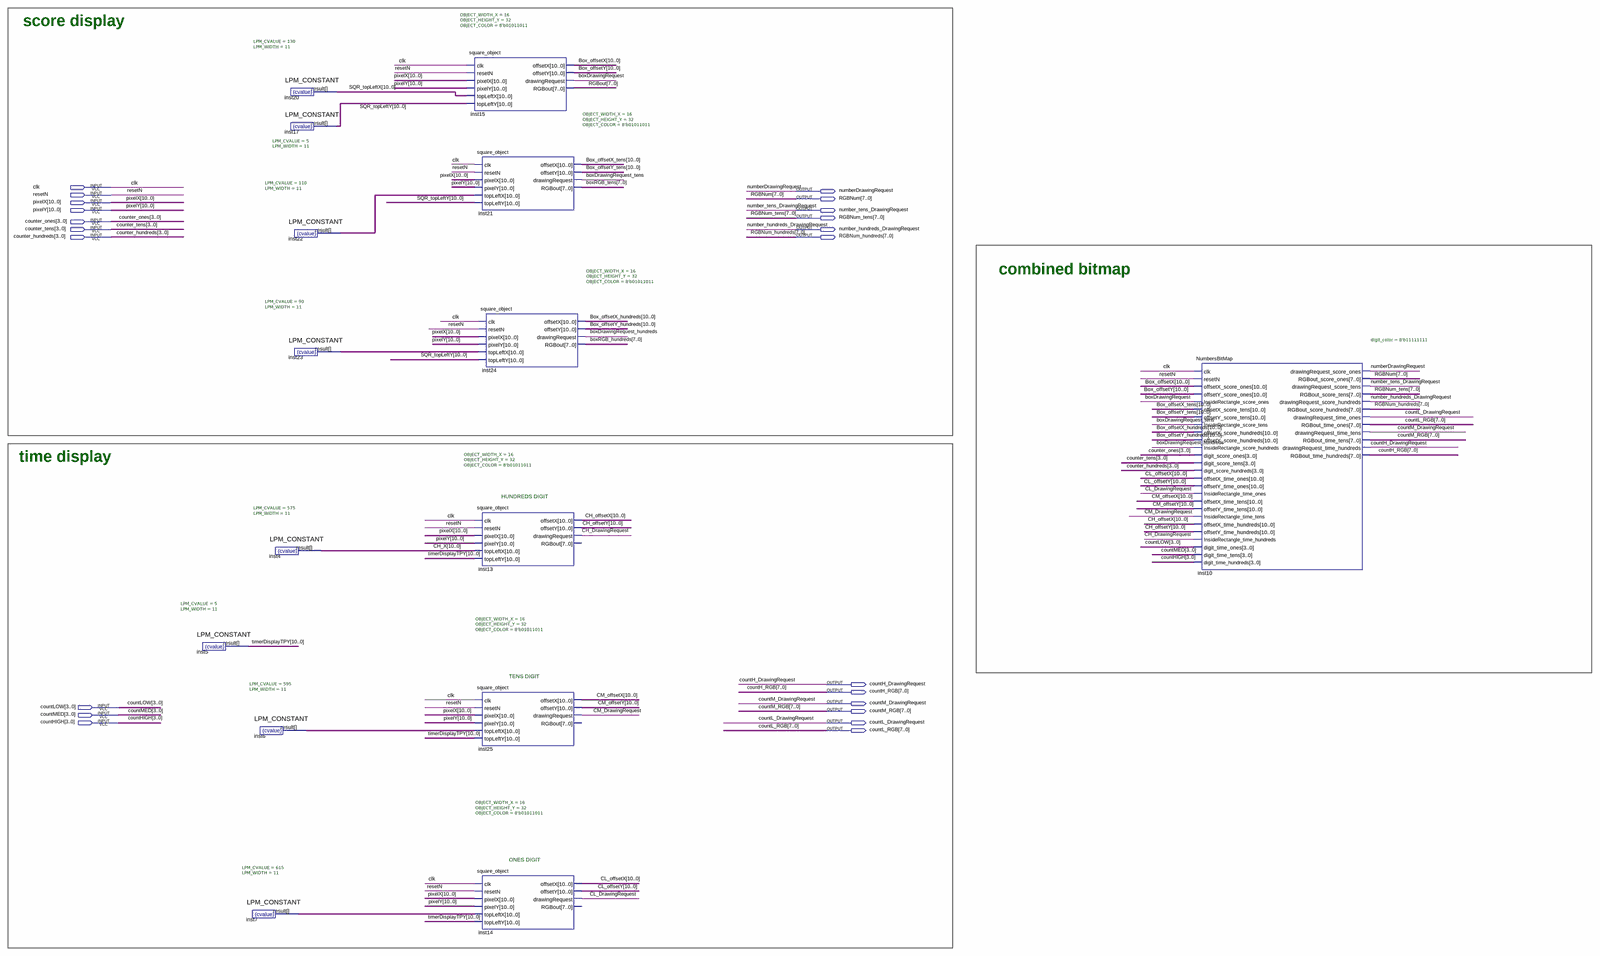
[diagram p0: schematic sheet, whole]
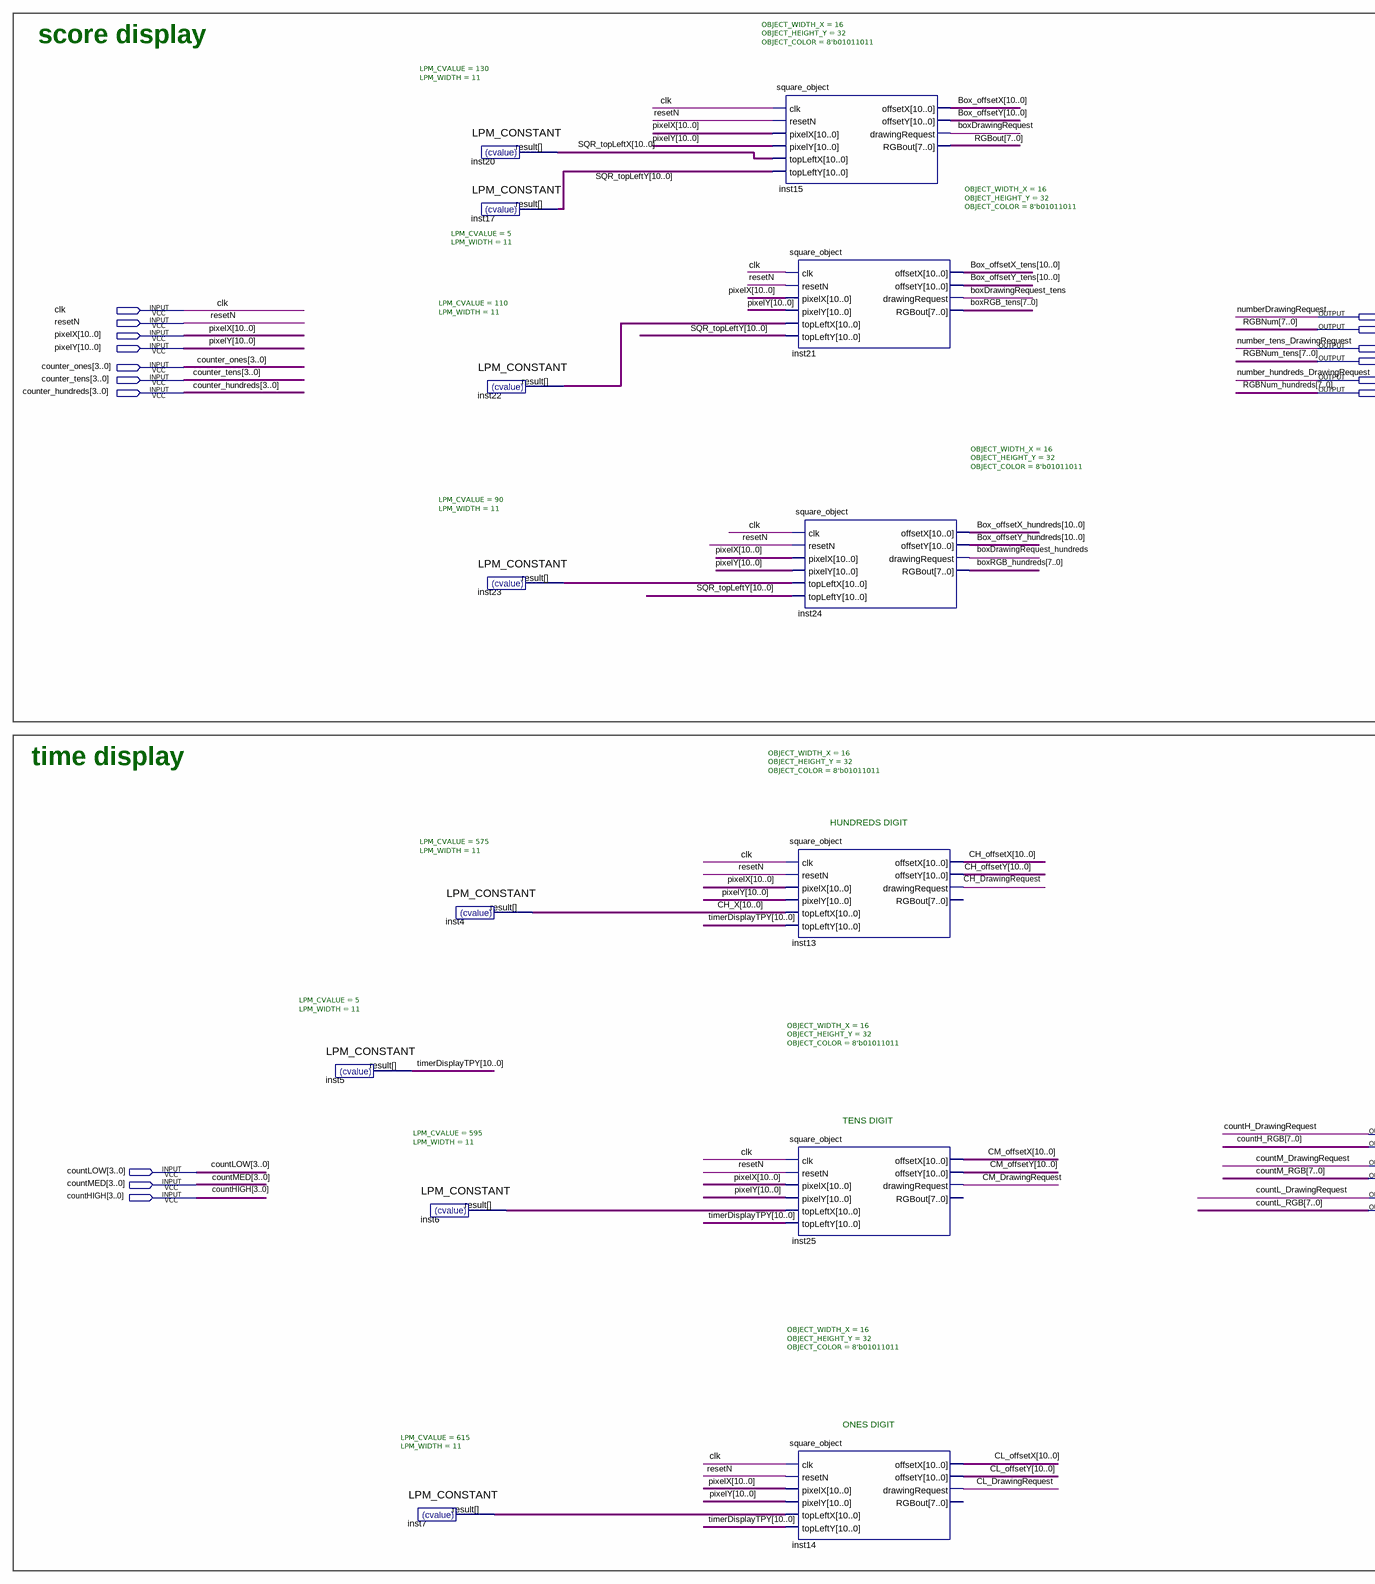
[diagram p1: schematic sheet, left part]
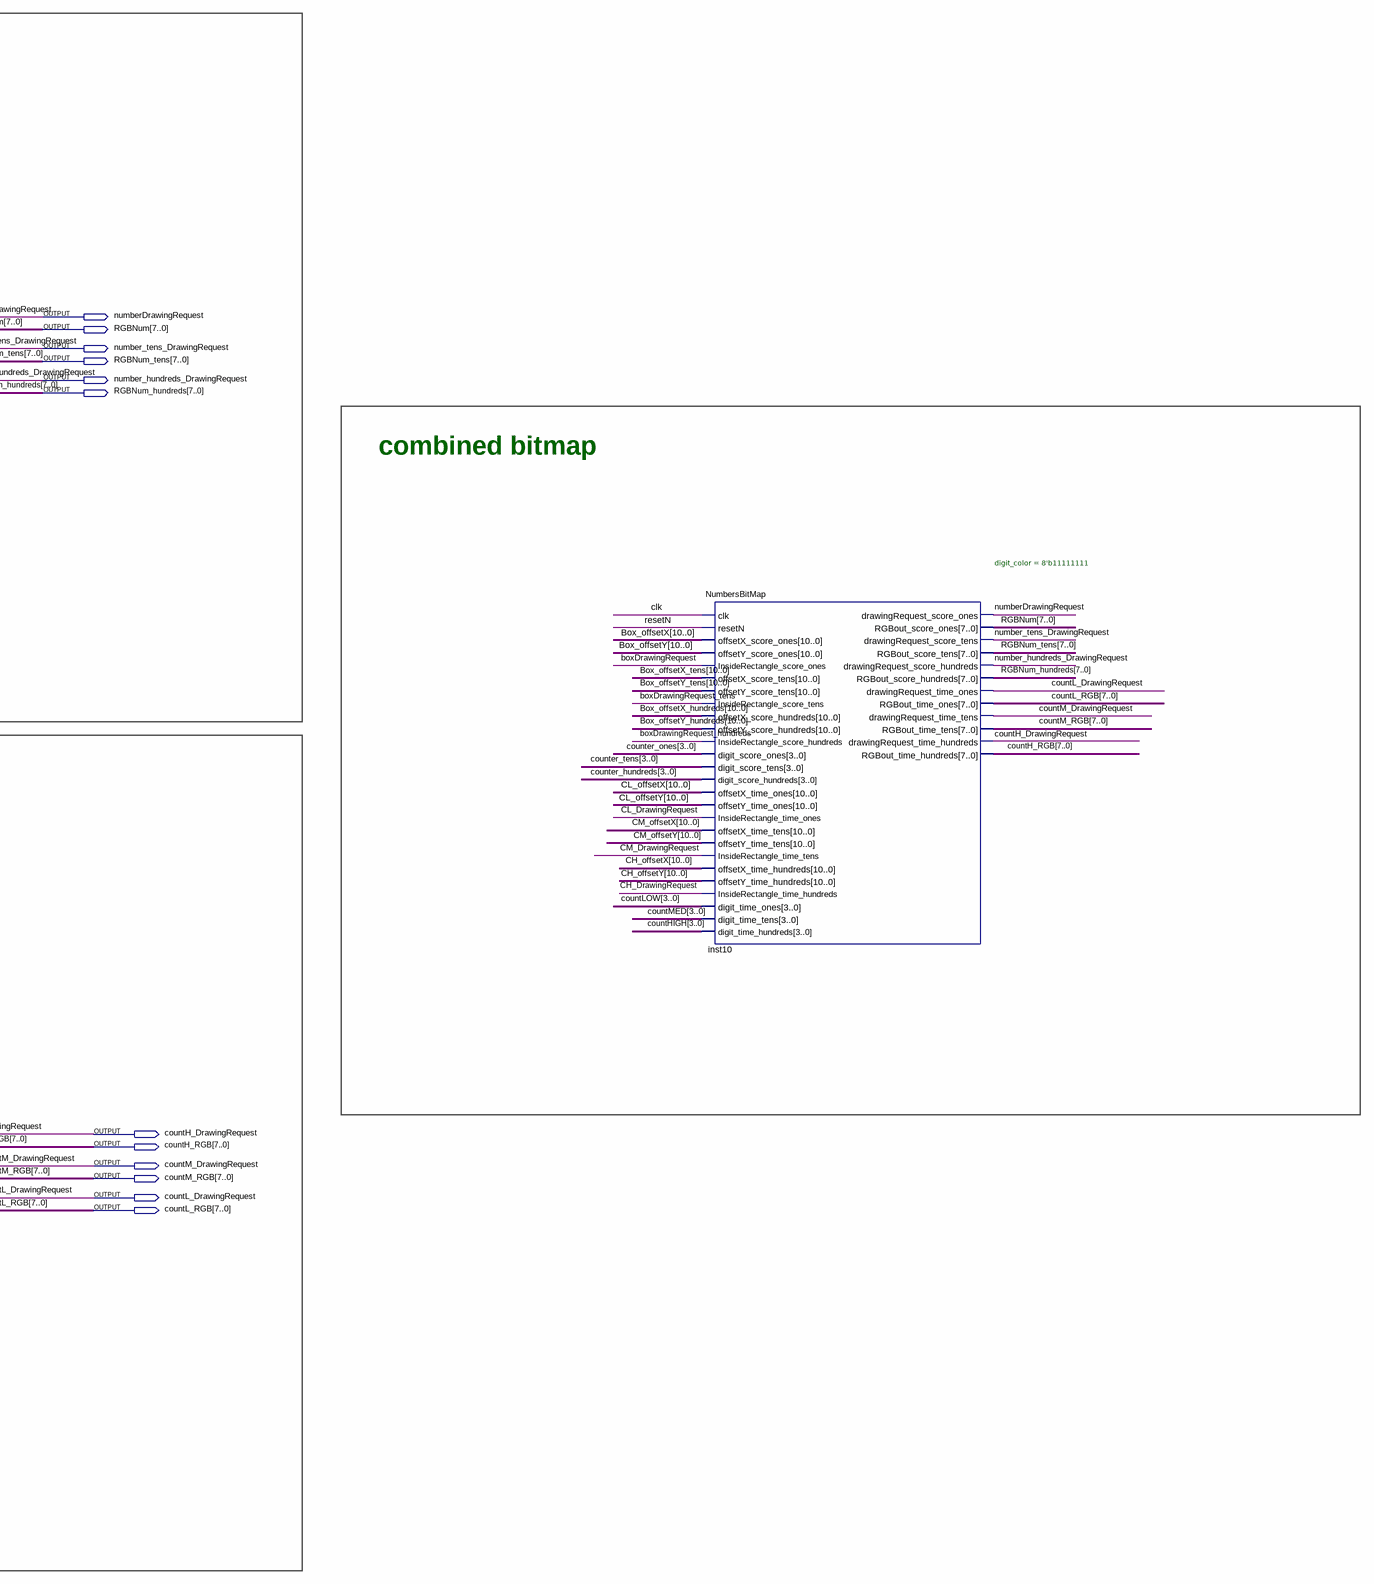
[diagram p2: schematic sheet, right part]
// Quartus schematic Score_and_Time_Display_Block.bdf as structural Verilog: 15 symbols, 22 pins
module Score_and_Time_Display_Block (
  input  clk,
  input  resetN,
  input  [10:0] pixelX,
  input  [10:0] pixelY,
  input  [3:0] counter_ones,
  input  [3:0] counter_tens,
  input  [3:0] counter_hundreds,
  input  [3:0] countLOW,
  input  [3:0] countMED,
  input  [3:0] countHIGH,
  output numberDrawingRequest,
  output [7:0] RGBNum,
  output number_tens_DrawingRequest,
  output [7:0] RGBNum_tens,
  output number_hundreds_DrawingRequest,
  output [7:0] RGBNum_hundreds,
  output countH_DrawingRequest,
  output [7:0] countH_RGB,
  output countM_DrawingRequest,
  output [7:0] countM_RGB,
  output countL_DrawingRequest,
  output [7:0] countL_RGB
);

  wire boxDrawingRequest, boxDrawingRequest_hundreds, boxDrawingRequest_tens, CH_DrawingRequest,
       CL_DrawingRequest, CM_DrawingRequest;
  wire [7:0] boxRGB_hundreds, boxRGB_tens, RGBout;
  wire [10:0] Box_offsetX, Box_offsetX_hundreds, Box_offsetX_tens, Box_offsetY, Box_offsetY_hundreds,
       Box_offsetY_tens, CH_offsetX, CH_offsetY, CH_X, CL_offsetX, CL_offsetY, CM_offsetX, CM_offsetY,
       inst6_result, inst7_result, inst22_result, inst23_result, SQR_topLeftX, SQR_topLeftY, timerDisplayTPY;

  LPM_CONSTANT #(.LPM_CVALUE(5), .LPM_WIDTH(11)) inst5 (.result(timerDisplayTPY));
  LPM_CONSTANT #(.LPM_CVALUE(595), .LPM_WIDTH(11)) inst6 (.result(inst6_result));
  LPM_CONSTANT #(.LPM_CVALUE(615), .LPM_WIDTH(11)) inst7 (.result(inst7_result));
  LPM_CONSTANT #(.LPM_CVALUE(130), .LPM_WIDTH(11)) inst20 (.result(SQR_topLeftX));
  LPM_CONSTANT #(.LPM_CVALUE(5), .LPM_WIDTH(11)) inst17 (.result(SQR_topLeftY));
  LPM_CONSTANT #(.LPM_CVALUE(110), .LPM_WIDTH(11)) inst22 (.result(inst22_result));
  LPM_CONSTANT #(.LPM_CVALUE(90), .LPM_WIDTH(11)) inst23 (.result(inst23_result));
  LPM_CONSTANT #(.LPM_CVALUE(575), .LPM_WIDTH(11)) inst4 (.result(CH_X));
  square_object #(.OBJECT_WIDTH_X(16), .OBJECT_HEIGHT_Y(32), .OBJECT_COLOR(8'b01011011)) inst15 (
    .clk(clk), .resetN(resetN), .pixelX(pixelX), .pixelY(pixelY), .topLeftX(SQR_topLeftX),
    .topLeftY(SQR_topLeftY), .offsetX(Box_offsetX), .offsetY(Box_offsetY),
    .drawingRequest(boxDrawingRequest), .RGBout(RGBout));
  square_object #(.OBJECT_WIDTH_X(16), .OBJECT_HEIGHT_Y(32), .OBJECT_COLOR(8'b01011011)) inst21 (
    .clk(clk), .resetN(resetN), .pixelX(pixelX), .pixelY(pixelY), .topLeftX(inst22_result),
    .topLeftY(SQR_topLeftY), .offsetX(Box_offsetX_tens), .offsetY(Box_offsetY_tens),
    .drawingRequest(boxDrawingRequest_tens), .RGBout(boxRGB_tens));
  square_object #(.OBJECT_WIDTH_X(16), .OBJECT_HEIGHT_Y(32), .OBJECT_COLOR(8'b01011011)) inst24 (
    .clk(clk), .resetN(resetN), .pixelX(pixelX), .pixelY(pixelY), .topLeftX(inst23_result),
    .topLeftY(SQR_topLeftY), .offsetX(Box_offsetX_hundreds), .offsetY(Box_offsetY_hundreds),
    .drawingRequest(boxDrawingRequest_hundreds), .RGBout(boxRGB_hundreds));
  square_object #(.OBJECT_WIDTH_X(16), .OBJECT_HEIGHT_Y(32), .OBJECT_COLOR(8'b01011011)) inst13 (
    .clk(clk), .resetN(resetN), .pixelX(pixelX), .pixelY(pixelY), .topLeftX(CH_X),
    .topLeftY(timerDisplayTPY), .offsetX(CH_offsetX), .offsetY(CH_offsetY), .drawingRequest(CH_DrawingRequest));  // open: RGBout
  square_object #(.OBJECT_WIDTH_X(16), .OBJECT_HEIGHT_Y(32), .OBJECT_COLOR(8'b01011011)) inst25 (
    .clk(clk), .resetN(resetN), .pixelX(pixelX), .pixelY(pixelY), .topLeftX(inst6_result),
    .topLeftY(timerDisplayTPY), .offsetX(CM_offsetX), .offsetY(CM_offsetY), .drawingRequest(CM_DrawingRequest));  // open: RGBout
  square_object #(.OBJECT_WIDTH_X(16), .OBJECT_HEIGHT_Y(32), .OBJECT_COLOR(8'b01011011)) inst14 (
    .clk(clk), .resetN(resetN), .pixelX(pixelX), .pixelY(pixelY), .topLeftX(inst7_result),
    .topLeftY(timerDisplayTPY), .offsetX(CL_offsetX), .offsetY(CL_offsetY), .drawingRequest(CL_DrawingRequest));  // open: RGBout
  NumbersBitMap #(.digit_color(8'b11111111)) inst10 (
    .clk(clk), .resetN(resetN), .offsetX_score_ones(Box_offsetX), .offsetY_score_ones(Box_offsetY),
    .InsideRectangle_score_ones(boxDrawingRequest), .offsetX_score_tens(Box_offsetX_tens),
    .offsetY_score_tens(Box_offsetY_tens), .InsideRectangle_score_tens(boxDrawingRequest_tens),
    .offsetX_score_hundreds(Box_offsetX_hundreds), .offsetY_score_hundreds(Box_offsetY_hundreds),
    .InsideRectangle_score_hundreds(boxDrawingRequest_hundreds), .digit_score_ones(counter_ones),
    .digit_score_tens(counter_tens), .digit_score_hundreds(counter_hundreds), .offsetX_time_ones(CL_offsetX),
    .offsetY_time_ones(CL_offsetY), .InsideRectangle_time_ones(CL_DrawingRequest),
    .offsetX_time_tens(CM_offsetX), .offsetY_time_tens(CM_offsetY),
    .InsideRectangle_time_tens(CM_DrawingRequest), .offsetX_time_hundreds(CH_offsetX),
    .offsetY_time_hundreds(CH_offsetY), .InsideRectangle_time_hundreds(CH_DrawingRequest),
    .digit_time_ones(countLOW), .digit_time_tens(countMED), .digit_time_hundreds(countHIGH),
    .drawingRequest_score_ones(numberDrawingRequest), .RGBout_score_ones(RGBNum),
    .drawingRequest_score_tens(number_tens_DrawingRequest), .RGBout_score_tens(RGBNum_tens),
    .drawingRequest_score_hundreds(number_hundreds_DrawingRequest), .RGBout_score_hundreds(RGBNum_hundreds),
    .drawingRequest_time_ones(countL_DrawingRequest), .RGBout_time_ones(countL_RGB),
    .drawingRequest_time_tens(countM_DrawingRequest), .RGBout_time_tens(countM_RGB),
    .drawingRequest_time_hundreds(countH_DrawingRequest), .RGBout_time_hundreds(countH_RGB));

  // Notes on the sheet:
  //   score display      
  //   combined bitmap
  //   time display      
  //   HUNDREDS DIGIT
  //   TENS DIGIT
  //   ONES DIGIT
endmodule
